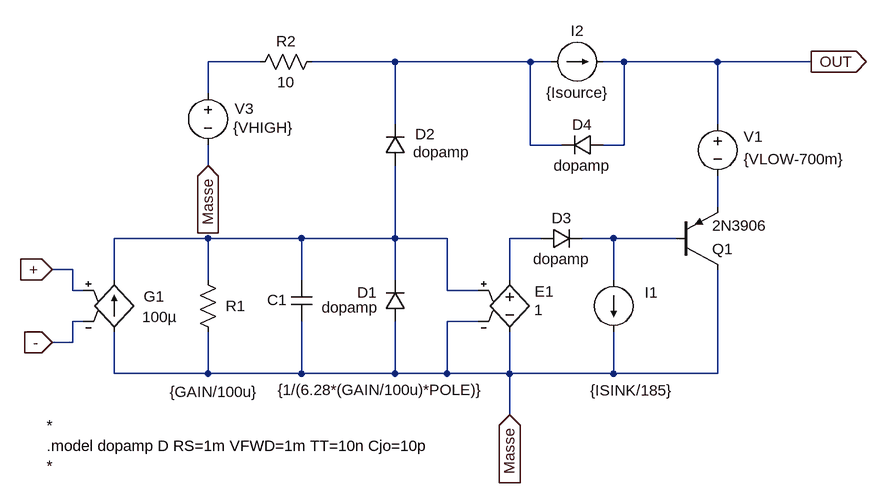
[diagram p0: schematic op_amp_fan_out.asc]
op_amp_fan_out.asc, the LTspice schematic file:
Version 4.1
SHEET 1 1504 680
WIRE 96 -224 16 -224
WIRE 304 -224 176 -224
WIRE 512 -224 304 -224
WIRE 544 -224 512 -224
WIRE 656 -224 624 -224
WIRE 800 -224 656 -224
WIRE 944 -224 800 -224
WIRE 16 -176 16 -224
WIRE 304 -128 304 -224
WIRE 800 -128 800 -224
WIRE 512 -96 512 -224
WIRE 560 -96 512 -96
WIRE 656 -96 656 -224
WIRE 656 -96 624 -96
WIRE 16 -64 16 -96
WIRE 800 0 800 -48
WIRE 16 48 -128 48
WIRE 160 48 16 48
WIRE 304 48 304 -64
WIRE 304 48 160 48
WIRE 384 48 304 48
WIRE 528 48 480 48
WIRE 640 48 592 48
WIRE 736 48 640 48
WIRE -192 96 -224 96
WIRE -128 112 -128 48
WIRE 16 112 16 48
WIRE 160 112 160 48
WIRE 304 112 304 48
WIRE 480 112 480 48
WIRE 640 112 640 48
WIRE -192 128 -192 96
WIRE -176 128 -192 128
WIRE 384 128 384 48
WIRE 432 128 384 128
WIRE -176 176 -192 176
WIRE 432 176 384 176
WIRE -192 208 -192 176
WIRE -192 208 -224 208
WIRE -128 256 -128 192
WIRE 16 256 16 192
WIRE 16 256 -128 256
WIRE 160 256 160 176
WIRE 160 256 16 256
WIRE 304 256 304 176
WIRE 304 256 160 256
WIRE 384 256 384 176
WIRE 384 256 304 256
WIRE 480 256 480 192
WIRE 480 256 384 256
WIRE 640 256 640 192
WIRE 640 256 480 256
WIRE 800 256 800 96
WIRE 800 256 640 256
WIRE 480 320 480 256
FLAG -224 96 +
IOPIN -224 96 In
FLAG -224 208 -
IOPIN -224 208 In
FLAG 944 -224 OUT
IOPIN 944 -224 Out
FLAG 480 320 Masse
IOPIN 480 320 In
FLAG 16 -64 Masse
IOPIN 16 -64 In
DATAFLAG 800 -16 ""
SYMBOL g -128 96 R0
WINDOW 0 45 41 Left 2
WINDOW 3 43 73 Left 2
SYMATTR InstName G1
SYMATTR Value 100µ
SYMBOL res 0 96 R0
WINDOW 0 43 56 Left 2
WINDOW 3 -43 188 Left 2
SYMATTR InstName R1
SYMATTR Value {GAIN/100u}
SYMBOL cap 144 112 R0
WINDOW 0 -37 31 Left 2
WINDOW 3 -21 169 Left 2
SYMATTR InstName C1
SYMATTR Value {1/(6.28*(GAIN/100u)*POLE)}
SYMBOL diode 320 176 R180
WINDOW 0 44 45 Left 2
WINDOW 3 41 22 Left 2
SYMATTR InstName D1
SYMATTR Value dopamp
SYMBOL e 480 96 R0
WINDOW 0 39 34 Left 2
WINDOW 3 38 62 Left 2
SYMATTR InstName E1
SYMATTR Value 1
SYMBOL diode 528 64 R270
WINDOW 0 32 32 VTop 2
WINDOW 3 0 32 VBottom 2
SYMATTR InstName D3
SYMATTR Value dopamp
SYMBOL current 640 112 R0
WINDOW 0 48 19 Left 2
WINDOW 3 -36 170 Left 2
SYMATTR InstName I1
SYMATTR Value {ISINK/185}
SYMBOL pnp 736 96 M180
SYMATTR InstName Q1
SYMATTR Value 2N3906
SYMBOL voltage 800 -144 R0
WINDOW 0 40 35 Left 2
WINDOW 3 40 70 Left 2
SYMATTR InstName V1
SYMATTR Value {VLOW-700m}
SYMBOL current 544 -224 R270
WINDOW 0 32 40 VTop 2
WINDOW 3 -32 40 VBottom 2
SYMATTR InstName I2
SYMATTR Value {Isource}
SYMBOL diode 624 -80 M270
WINDOW 0 32 32 VTop 2
WINDOW 3 0 32 VBottom 2
SYMATTR InstName D4
SYMATTR Value dopamp
SYMBOL voltage 16 -192 R0
WINDOW 0 41 40 Left 2
WINDOW 3 39 69 Left 2
SYMATTR InstName V3
SYMATTR Value {VHIGH}
SYMBOL diode 288 -64 M180
WINDOW 0 47 49 Left 2
WINDOW 3 44 21 Left 2
SYMATTR InstName D2
SYMATTR Value dopamp
SYMBOL res 192 -240 R90
WINDOW 0 0 56 VBottom 2
WINDOW 3 32 56 VTop 2
SYMATTR InstName R2
SYMATTR Value 10
TEXT -232 336 Left 2 !*\n.model dopamp D RS=1m VFWD=1m TT=10n Cjo=10p\n*

The netlist it stands for:
* op_amp_fan_out.asc
G1 Masse N004 + - 100µ
R1 N004 Masse {GAIN/100u}
C1 N004 Masse {1/(6.28*(GAIN/100u)*POLE)}
D1 Masse N004 dopamp
E1 N005 Masse N004 Masse 1
D3 N005 N006 dopamp
I1 N006 Masse {ISINK/185}
Q1 Masse N006 N003 0 2N3906
V1 OUT N003 {VLOW-700m}
I2 N002 OUT {Isource}
D4 OUT N002 dopamp
V3 N001 Masse {VHIGH}
D2 N004 N002 dopamp
R2 N002 N001 10
.model D D
.lib standard.dio
.model NPN NPN
.model PNP PNP
.lib standard.bjt
*
.model dopamp D RS=1m VFWD=1m TT=10n Cjo=10p
*
.backanno
.end